# Altium schematic sheet PowerSwitchBoard.SchDoc
size A4
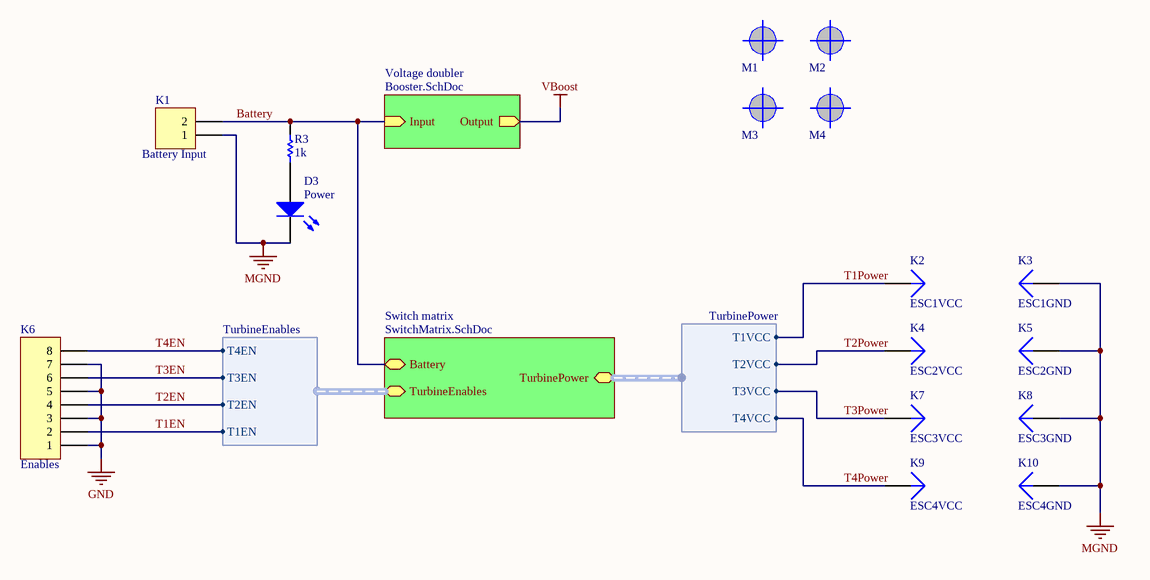
[diagram p0: PowerSwitchBoard.SchDoc]

## Parts
D3  Power  [LED-3MM-GREEN]
K1  Battery Input  [CONN-SB-0.2-2WAY]
K2  ESC1VCC  [CONN-BULLET-3.5-HF]
K3  ESC1GND  [CONN-BULLET-3.5-HF]
K4  ESC2VCC  [CONN-BULLET-3.5-HF]
K5  ESC2GND  [CONN-BULLET-3.5-HF]
K6  Enables  [CONN-HDR-0.1-1x8-SOCKH]
K7  ESC3VCC  [CONN-BULLET-3.5-HF]
K8  ESC3GND  [CONN-BULLET-3.5-HF]
K9  ESC4VCC  [CONN-BULLET-3.5-HF]
K10  ESC4GND  [CONN-BULLET-3.5-HF]
M1  Fiducial  [MECH-FID-ALL]  (value not drawn)
M2  Fiducial  [MECH-FID-ALL]  (value not drawn)
M3  Fiducial  [MECH-FID-ALL]  (value not drawn)
M4  Fiducial  [MECH-FID-ALL]  (value not drawn)
R3  1k  [RES-0.4]

## Sub-sheets
Switch matrix = SwitchMatrix.SchDoc: Battery, TurbinePower (harness TurbinePower), TurbineEnables (harness TurbineEnables)
Voltage doubler = Booster.SchDoc: Input (in), Output (out)

## Harnesses
TurbinePower: T1VCC, T2VCC, T3VCC, T4VCC
TurbineEnables: T1EN, T2EN, T3EN, T4EN

## Nets
GND: K6.1 K6.3 K6.5 K6.7
MGND: D3.2(K) K1.1 K3.1 K5.1 K8.1 K10.1
VBoost: sheet Voltage doubler/Output
Battery: K1.2 R3.1 ; sheet Switch matrix/Battery, sheet Voltage doubler/Input
T1EN: K6.2 ; sheet Switch matrix/TurbineEnables.T1EN
T1Power: K2.1 ; sheet Switch matrix/TurbinePower.T1VCC
T2EN: K6.4 ; sheet Switch matrix/TurbineEnables.T2EN
T2Power: K4.1 ; sheet Switch matrix/TurbinePower.T2VCC
T3EN: K6.6 ; sheet Switch matrix/TurbineEnables.T3EN
T3Power: K7.1 ; sheet Switch matrix/TurbinePower.T3VCC
T4EN: K6.8 ; sheet Switch matrix/TurbineEnables.T4EN
T4Power: K9.1 ; sheet Switch matrix/TurbinePower.T4VCC
NetD3_1: D3.1(A) R3.2

## Library data of the parts
D3 = LED0: Typical 3mm green LED; Published: 8-Jun-2000; LatestRevisionDate: 08-Jul-2005; LatestRevisionNote: Mech Layer 1 removed.; PackageReference: LED-0; Publisher: Altium Limited; PackageDescription: LED; 2 Leads
K1 = Header 2: Header, 2-Pin; LatestRevisionDate: 17-Jul-2002; LatestRevisionNote: Re-released for DXP Platform.; Publisher: Altium Limited
K2-K5 K7-K10 = Plug: LatestRevisionDate: 17-Jul-2002; LatestRevisionNote: Re-released for DXP Platform.; Publisher: Altium Limited
K6 = Header 8H: Header, 8-Pin, Right Angle; LatestRevisionDate: 17-Jul-2002; LatestRevisionNote: Re-released for DXP Platform.; Publisher: Altium Limited
M1-M4 = Fiducial: Fiducial marking
R3 = Res1: Resistor; Published: 8-Jun-2000; LatestRevisionDate: 17-Jul-2002; LatestRevisionNote: Re-released for DXP Platform.; PackageReference: AXIAL-0.3; Publisher: Altium Limited; PackageDescription: Axial Device, Thru-Hole; 2 Leads; 0.3 in Pin Spacing; Value: 1k